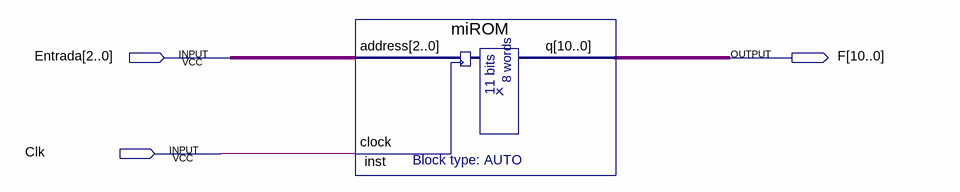
[diagram p0: schematic sheet]
// Quartus schematic ROM.bdf as structural Verilog: 1 symbols, 3 pins
module ROM (
  input  [2:0] Entrada,
  input  Clk,
  output [10:0] F
);

  miROM inst (.address(Entrada), .clock(Clk), .q(F));
endmodule
